# EAGLE design lamloei_breadout_a15001 (EAGLE 7.7.0)
CNAME: LamLoei breadout A15001; CREVISION: R1; DESIGNER: lamloei co.,ltd.
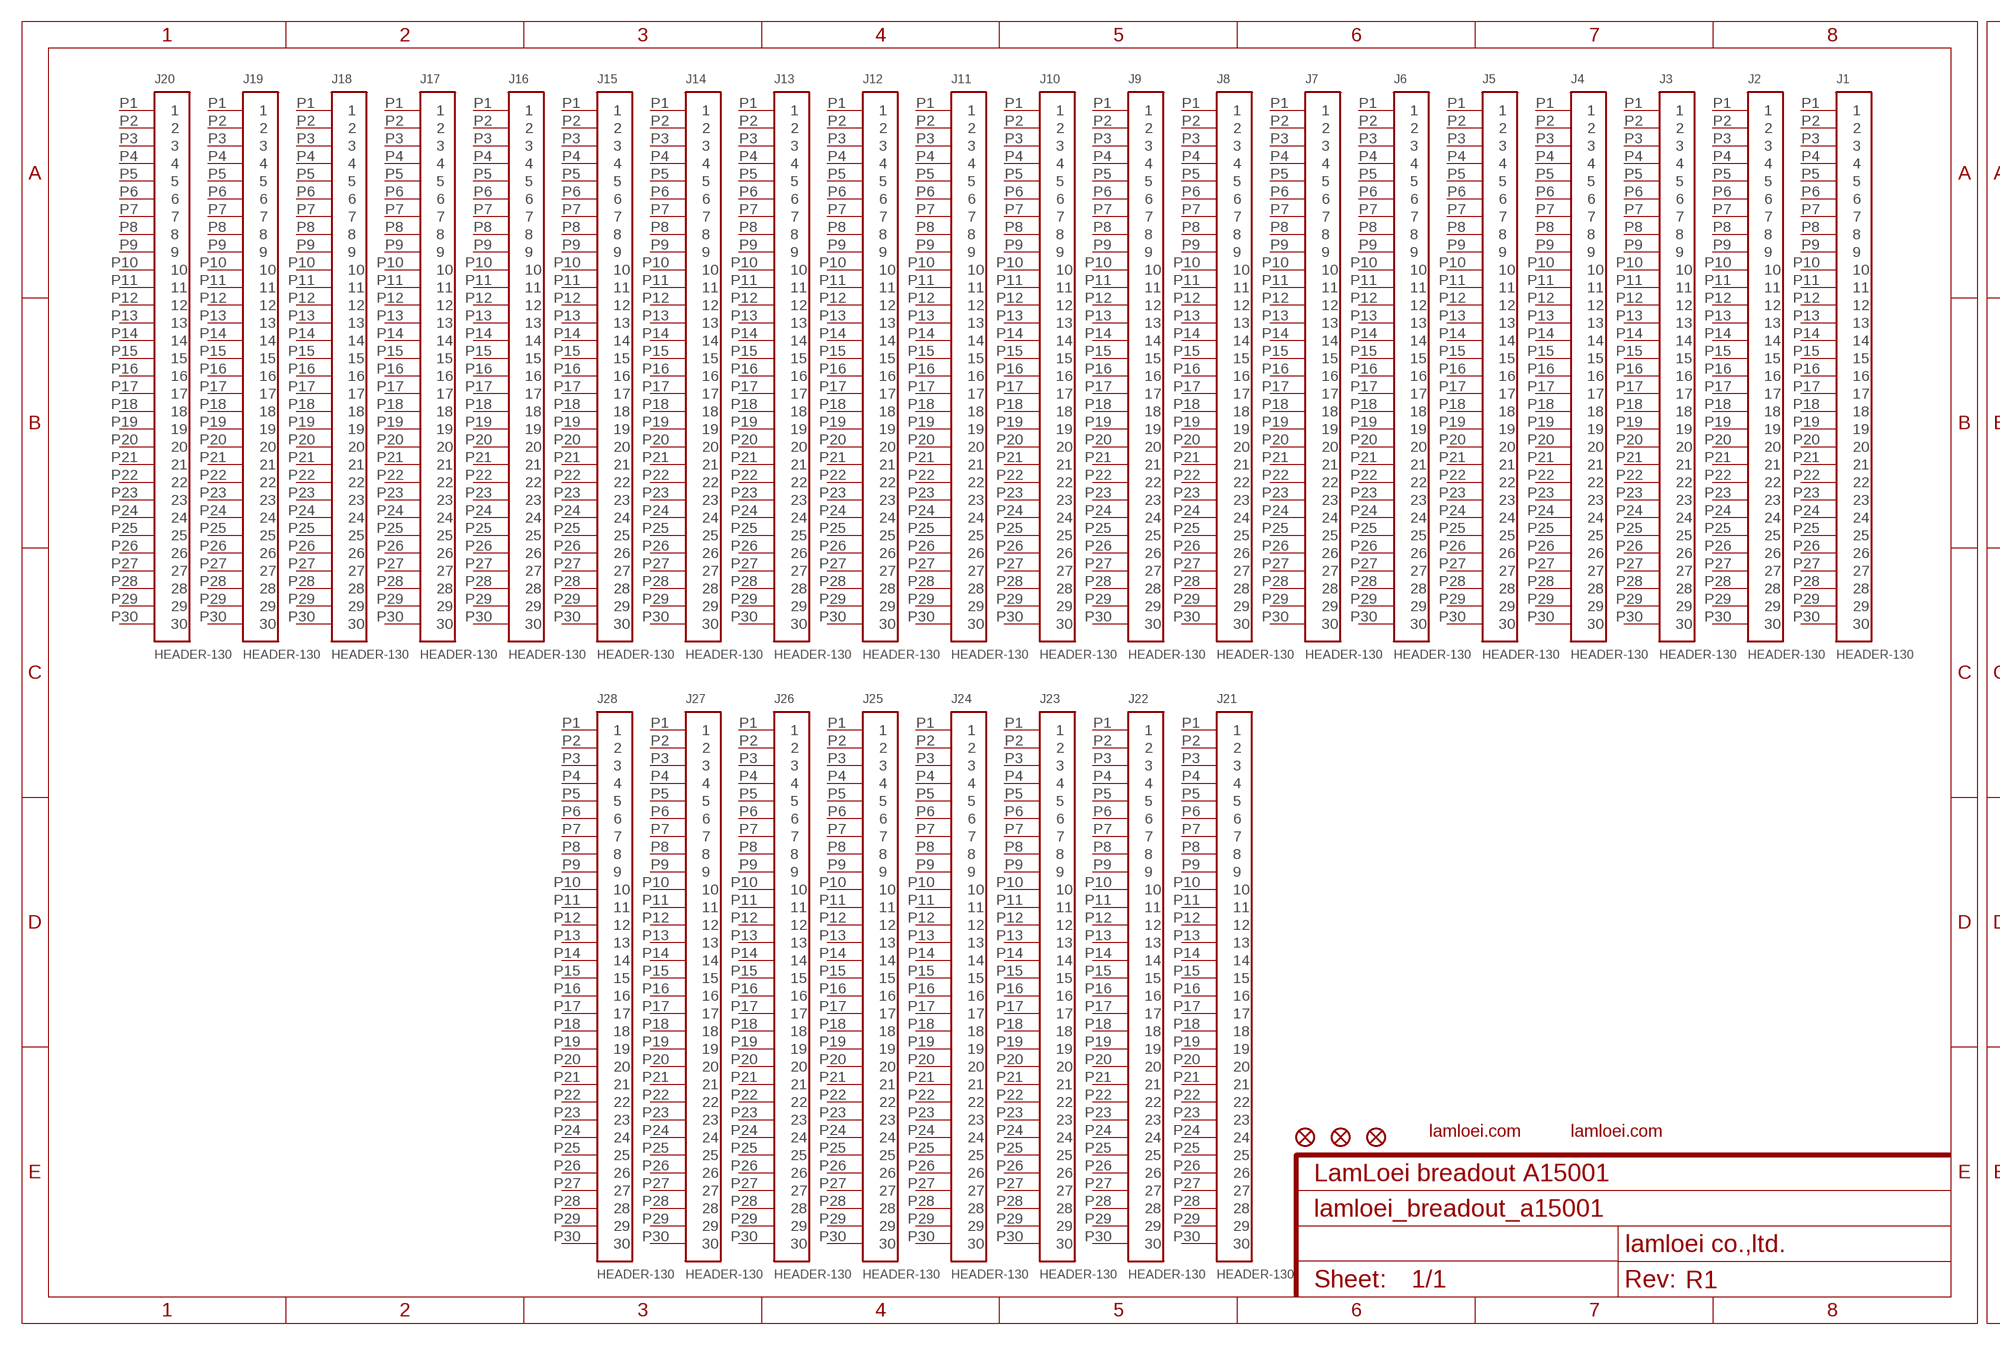
[diagram p0: schematic, sheet 1, part 1 of 2]
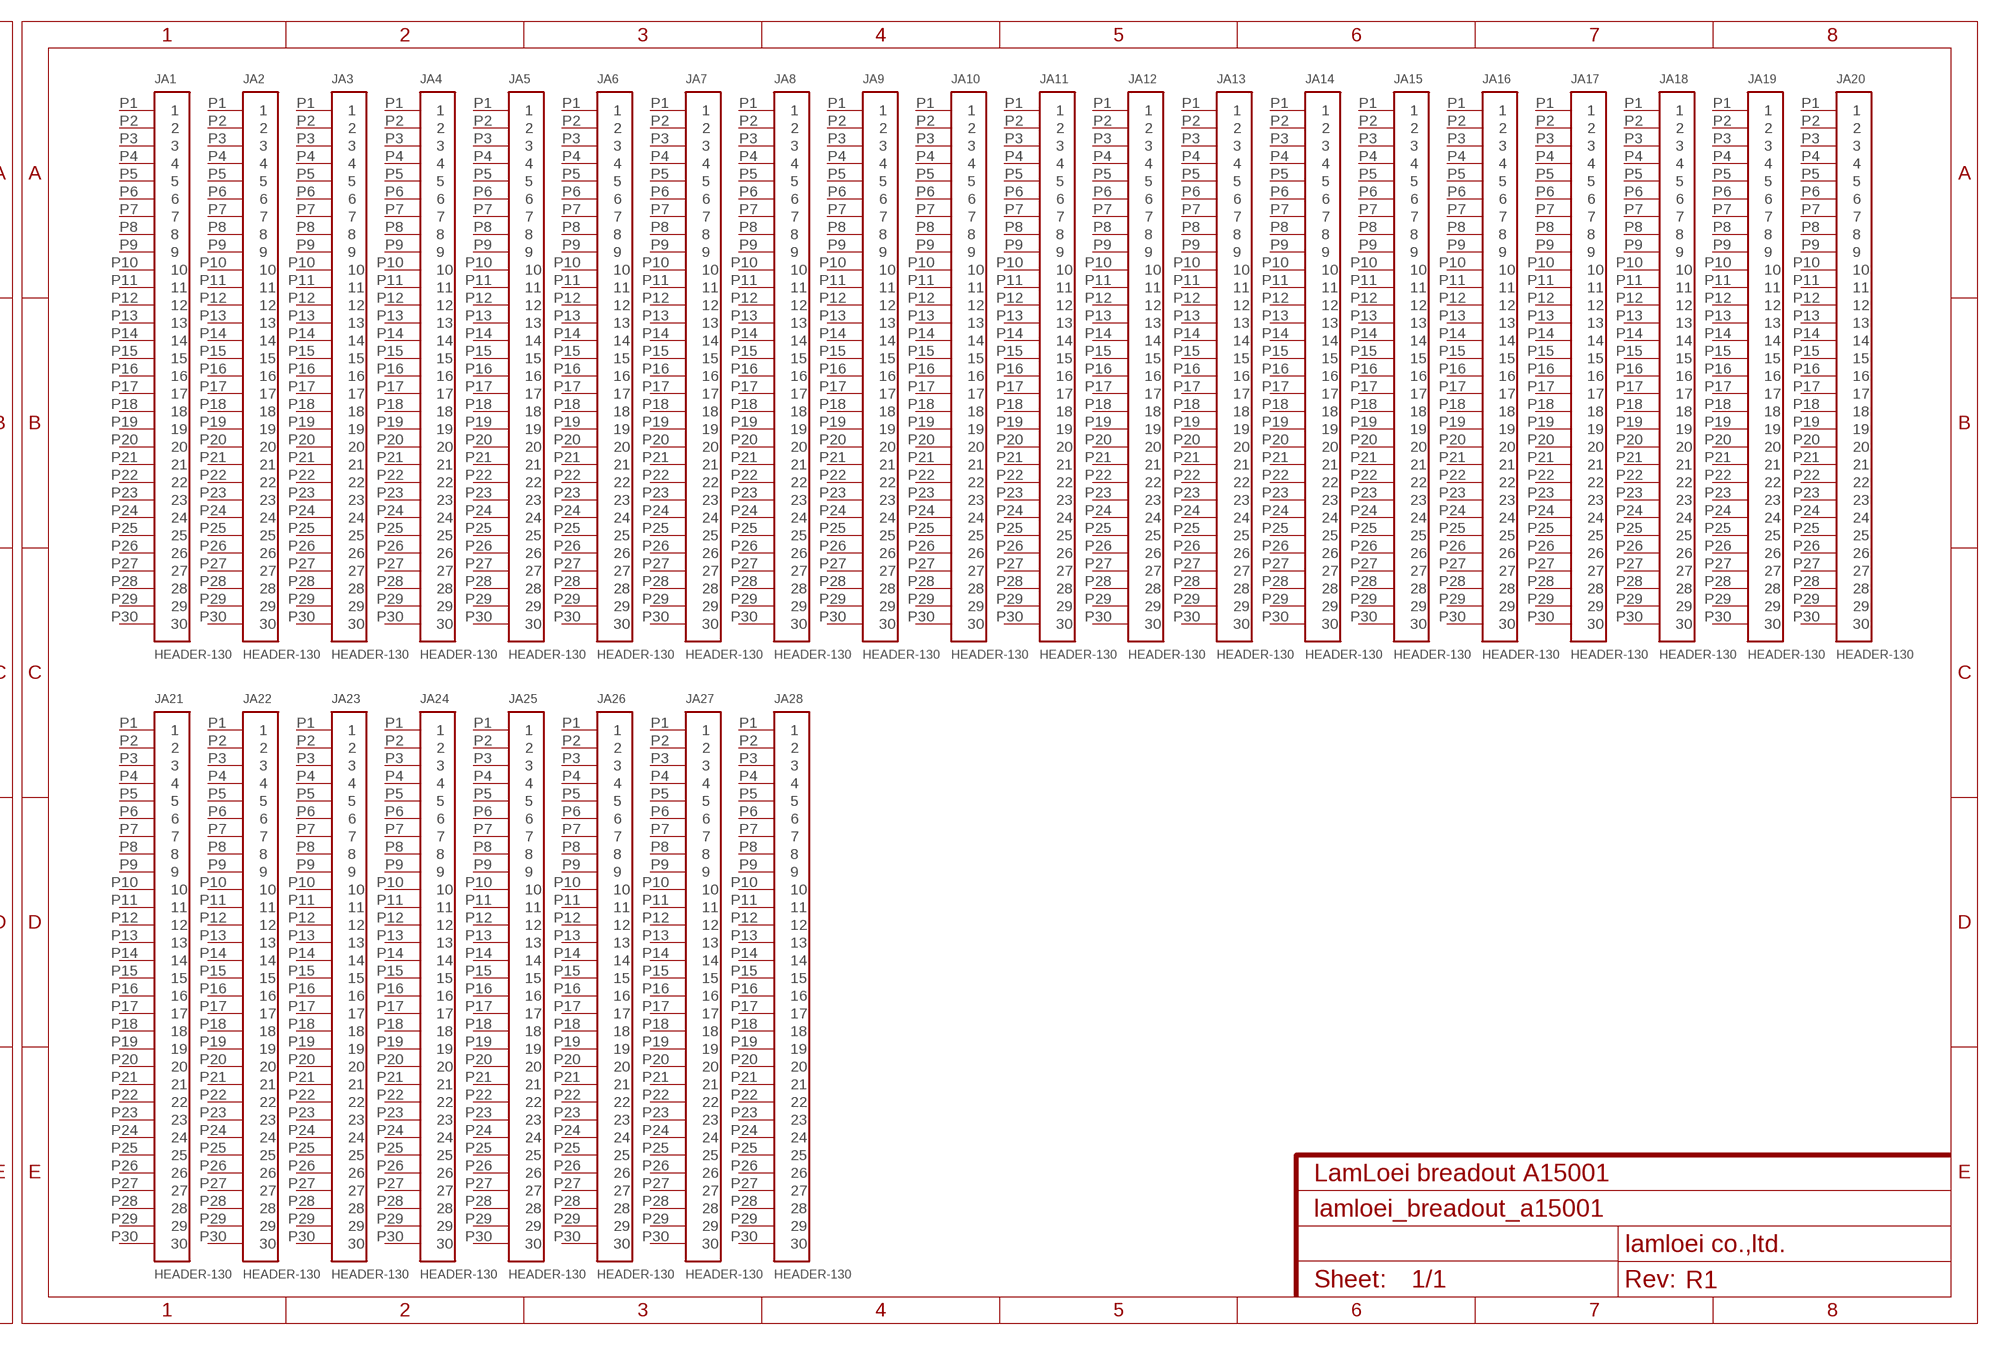
[diagram p1: schematic, sheet 1, part 2 of 2]

## Parts
J1  HEADER-130  [HEADER-130]
J2  HEADER-130  [HEADER-130]
J3  HEADER-130  [HEADER-130]
J4  HEADER-130  [HEADER-130]
J5  HEADER-130  [HEADER-130]
J6  HEADER-130  [HEADER-130]
J7  HEADER-130  [HEADER-130]
J8  HEADER-130  [HEADER-130]
J9  HEADER-130  [HEADER-130]
J10  HEADER-130  [HEADER-130]
J11  HEADER-130  [HEADER-130]
J12  HEADER-130  [HEADER-130]
J13  HEADER-130  [HEADER-130]
J14  HEADER-130  [HEADER-130]
J15  HEADER-130  [HEADER-130]
J16  HEADER-130  [HEADER-130]
J17  HEADER-130  [HEADER-130]
J18  HEADER-130  [HEADER-130]
J19  HEADER-130  [HEADER-130]
J20  HEADER-130  [HEADER-130]
J21  HEADER-130  [HEADER-130]
J22  HEADER-130  [HEADER-130]
J23  HEADER-130  [HEADER-130]
J24  HEADER-130  [HEADER-130]
J25  HEADER-130  [HEADER-130]
J26  HEADER-130  [HEADER-130]
J27  HEADER-130  [HEADER-130]
J28  HEADER-130  [HEADER-130]
JA1  HEADER-130  [HEADER-130]
JA2  HEADER-130  [HEADER-130]
JA3  HEADER-130  [HEADER-130]
JA4  HEADER-130  [HEADER-130]
JA5  HEADER-130  [HEADER-130]
JA6  HEADER-130  [HEADER-130]
JA7  HEADER-130  [HEADER-130]
JA8  HEADER-130  [HEADER-130]
JA9  HEADER-130  [HEADER-130]
JA10  HEADER-130  [HEADER-130]
JA11  HEADER-130  [HEADER-130]
JA12  HEADER-130  [HEADER-130]
JA13  HEADER-130  [HEADER-130]
JA14  HEADER-130  [HEADER-130]
JA15  HEADER-130  [HEADER-130]
JA16  HEADER-130  [HEADER-130]
JA17  HEADER-130  [HEADER-130]
JA18  HEADER-130  [HEADER-130]
JA19  HEADER-130  [HEADER-130]
JA20  HEADER-130  [HEADER-130]
JA21  HEADER-130  [HEADER-130]
JA22  HEADER-130  [HEADER-130]
JA23  HEADER-130  [HEADER-130]
JA24  HEADER-130  [HEADER-130]
JA25  HEADER-130  [HEADER-130]
JA26  HEADER-130  [HEADER-130]
JA27  HEADER-130  [HEADER-130]
JA28  HEADER-130  [HEADER-130]
ZFD1  FIDUCIAL1X2  [FIDUCIAL-1X2]
ZFD2  FIDUCIAL1X2  [FIDUCIAL-1X2]
ZFD3  FIDUCIAL1X2  [FIDUCIAL-1X2]
ZL1  LAMLEOI_LOGO_3  [LAMLEOI_LOGO_3]
ZL2  LAMLEOI_LOGO_3  [LAMLEOI_LOGO_3]
Unconnected: J1.P1 J1.P2 J1.P3 J1.P4 J1.P5 J1.P6 J1.P7 J1.P8 J1.P9 J1.P10 J1.P11 J1.P12 J1.P13 J1.P14 J1.P15 J1.P16 J1.P17 J1.P18 J1.P19 J1.P20 J1.P21 J1.P22 J1.P23 J1.P24 J1.P25 J1.P26 J1.P27 J1.P28 J1.P29 J1.P30 J2.P1 J2.P2 J2.P3 J2.P4 J2.P5 J2.P6 J2.P7 J2.P8 J2.P9 J2.P10 J2.P11 J2.P12 J2.P13 J2.P14 J2.P15 J2.P16 J2.P17 J2.P18 J2.P19 J2.P20 J2.P21 J2.P22 J2.P23 J2.P24 J2.P25 J2.P26 J2.P27 J2.P28 J2.P29 J2.P30 J3.P1 J3.P2 J3.P3 J3.P4 J3.P5 J3.P6 J3.P7 J3.P8 J3.P9 J3.P10 J3.P11 J3.P12 J3.P13 J3.P14 J3.P15 J3.P16 J3.P17 J3.P18 J3.P19 J3.P20 J3.P21 J3.P22 J3.P23 J3.P24 J3.P25 J3.P26 J3.P27 J3.P28 J3.P29 J3.P30 J4.P1 J4.P2 J4.P3 J4.P4 J4.P5 J4.P6 J4.P7 J4.P8 J4.P9 J4.P10 J4.P11 J4.P12 J4.P13 J4.P14 J4.P15 J4.P16 J4.P17 J4.P18 J4.P19 J4.P20 J4.P21 J4.P22 J4.P23 J4.P24 J4.P25 J4.P26 J4.P27 J4.P28 J4.P29 J4.P30 J5.P1 J5.P2 J5.P3 J5.P4 J5.P5 J5.P6 J5.P7 J5.P8 J5.P9 J5.P10 J5.P11 J5.P12 J5.P13 J5.P14 J5.P15 J5.P16 J5.P17 J5.P18 J5.P19 J5.P20 J5.P21 J5.P22 J5.P23 J5.P24 J5.P25 J5.P26 J5.P27 J5.P28 J5.P29 J5.P30 J6.P1 J6.P2 J6.P3 J6.P4 J6.P5 J6.P6 J6.P7 J6.P8 J6.P9 J6.P10 J6.P11 J6.P12 J6.P13 J6.P14 J6.P15 J6.P16 J6.P17 J6.P18 J6.P19 J6.P20 J6.P21 J6.P22 J6.P23 J6.P24 J6.P25 J6.P26 J6.P27 J6.P28 J6.P29 J6.P30 J7.P1 J7.P2 J7.P3 J7.P4 J7.P5 J7.P6 J7.P7 J7.P8 J7.P9 J7.P10 J7.P11 J7.P12 J7.P13 J7.P14 J7.P15 J7.P16 J7.P17 J7.P18 J7.P19 J7.P20 J7.P21 J7.P22 J7.P23 J7.P24 J7.P25 J7.P26 J7.P27 J7.P28 J7.P29 J7.P30 J8.P1 J8.P2 J8.P3 J8.P4 J8.P5 J8.P6 J8.P7 J8.P8 J8.P9 J8.P10 J8.P11 J8.P12 J8.P13 J8.P14 J8.P15 J8.P16 J8.P17 J8.P18 J8.P19 J8.P20 J8.P21 J8.P22 J8.P23 J8.P24 J8.P25 J8.P26 J8.P27 J8.P28 J8.P29 J8.P30 J9.P1 J9.P2 J9.P3 J9.P4 J9.P5 J9.P6 J9.P7 J9.P8 J9.P9 J9.P10 J9.P11 J9.P12 J9.P13 J9.P14 J9.P15 J9.P16 J9.P17 J9.P18 J9.P19 J9.P20 J9.P21 J9.P22 J9.P23 J9.P24 J9.P25 J9.P26 J9.P27 J9.P28 J9.P29 J9.P30 J10.P1 J10.P2 J10.P3 J10.P4 J10.P5 J10.P6 J10.P7 J10.P8 J10.P9 J10.P10 J10.P11 J10.P12 J10.P13 J10.P14 J10.P15 J10.P16 J10.P17 J10.P18 J10.P19 J10.P20 J10.P21 J10.P22 J10.P23 J10.P24 J10.P25 J10.P26 J10.P27 J10.P28 J10.P29 J10.P30 J11.P1 J11.P2 J11.P3 J11.P4 J11.P5 J11.P6 J11.P7 J11.P8 J11.P9 J11.P10 J11.P11 J11.P12 J11.P13 J11.P14 J11.P15 J11.P16 J11.P17 J11.P18 J11.P19 J11.P20 J11.P21 J11.P22 J11.P23 J11.P24 J11.P25 J11.P26 J11.P27 J11.P28 J11.P29 J11.P30 J12.P1 J12.P2 J12.P3 J12.P4 J12.P5 J12.P6 J12.P7 J12.P8 J12.P9 J12.P10 J12.P11 J12.P12 J12.P13 J12.P14 J12.P15 J12.P16 J12.P17 J12.P18 J12.P19 J12.P20 J12.P21 J12.P22 J12.P23 J12.P24 J12.P25 J12.P26 J12.P27 J12.P28 J12.P29 J12.P30 J13.P1 J13.P2 J13.P3 J13.P4 J13.P5 J13.P6 J13.P7 J13.P8 J13.P9 J13.P10 J13.P11 J13.P12 J13.P13 J13.P14 J13.P15 J13.P16 J13.P17 J13.P18 J13.P19 J13.P20 J13.P21 J13.P22 J13.P23 J13.P24 J13.P25 J13.P26 J13.P27 J13.P28 J13.P29 J13.P30 J14.P1 J14.P2 J14.P3 J14.P4 J14.P5 J14.P6 J14.P7 J14.P8 J14.P9 J14.P10 J14.P11 J14.P12 J14.P13 J14.P14 J14.P15 J14.P16 J14.P17 J14.P18 J14.P19 J14.P20 J14.P21 J14.P22 J14.P23 J14.P24 J14.P25 J14.P26 J14.P27 J14.P28 J14.P29 J14.P30 J15.P1 J15.P2 J15.P3 J15.P4 J15.P5 J15.P6 J15.P7 J15.P8 J15.P9 J15.P10 J15.P11 J15.P12 J15.P13 J15.P14 J15.P15 J15.P16 J15.P17 J15.P18 J15.P19 J15.P20 J15.P21 J15.P22 J15.P23 J15.P24 J15.P25 J15.P26 J15.P27 J15.P28 J15.P29 J15.P30 J16.P1 J16.P2 J16.P3 J16.P4 J16.P5 J16.P6 J16.P7 J16.P8 J16.P9 J16.P10 J16.P11 J16.P12 J16.P13 J16.P14 J16.P15 J16.P16 J16.P17 J16.P18 J16.P19 J16.P20 J16.P21 J16.P22 J16.P23 J16.P24 J16.P25 J16.P26 J16.P27 J16.P28 J16.P29 J16.P30 J17.P1 J17.P2 J17.P3 J17.P4 J17.P5 J17.P6 J17.P7 J17.P8 J17.P9 J17.P10 J17.P11 J17.P12 J17.P13 J17.P14 J17.P15 J17.P16 J17.P17 J17.P18 J17.P19 J17.P20 J17.P21 J17.P22 J17.P23 J17.P24 J17.P25 J17.P26 J17.P27 J17.P28 J17.P29 J17.P30 J18.P1 J18.P2 J18.P3 J18.P4 J18.P5 J18.P6 J18.P7 J18.P8 J18.P9 J18.P10 J18.P11 J18.P12 J18.P13 J18.P14 J18.P15 J18.P16 J18.P17 J18.P18 J18.P19 J18.P20 J18.P21 J18.P22 J18.P23 J18.P24 J18.P25 J18.P26 J18.P27 J18.P28 J18.P29 J18.P30 J19.P1 J19.P2 J19.P3 J19.P4 J19.P5 J19.P6 J19.P7 J19.P8 J19.P9 J19.P10 J19.P11 J19.P12 J19.P13 J19.P14 J19.P15 J19.P16 J19.P17 J19.P18 J19.P19 J19.P20 J19.P21 J19.P22 J19.P23 J19.P24 J19.P25 J19.P26 J19.P27 J19.P28 J19.P29 J19.P30 J20.P1 J20.P2 J20.P3 J20.P4 J20.P5 J20.P6 J20.P7 J20.P8 J20.P9 J20.P10 J20.P11 J20.P12 J20.P13 J20.P14 J20.P15 J20.P16 J20.P17 J20.P18 J20.P19 J20.P20 J20.P21 J20.P22 J20.P23 J20.P24 J20.P25 J20.P26 J20.P27 J20.P28 J20.P29 J20.P30 J21.P1 J21.P2 J21.P3 J21.P4 J21.P5 J21.P6 J21.P7 J21.P8 J21.P9 J21.P10 J21.P11 J21.P12 J21.P13 J21.P14 J21.P15 J21.P16 J21.P17 J21.P18 J21.P19 J21.P20 J21.P21 J21.P22 J21.P23 J21.P24 J21.P25 J21.P26 J21.P27 J21.P28 J21.P29 J21.P30 J22.P1 J22.P2 J22.P3 J22.P4 J22.P5 J22.P6 J22.P7 J22.P8 J22.P9 J22.P10 J22.P11 J22.P12 J22.P13 J22.P14 J22.P15 J22.P16 J22.P17 J22.P18 J22.P19 J22.P20 J22.P21 J22.P22 J22.P23 J22.P24 J22.P25 J22.P26 J22.P27 J22.P28 J22.P29 J22.P30 J23.P1 J23.P2 J23.P3 J23.P4 J23.P5 J23.P6 J23.P7 J23.P8 J23.P9 J23.P10 J23.P11 J23.P12 J23.P13 J23.P14 J23.P15 J23.P16 J23.P17 J23.P18 J23.P19 J23.P20 J23.P21 J23.P22 J23.P23 J23.P24 J23.P25 J23.P26 J23.P27 J23.P28 J23.P29 J23.P30 J24.P1 J24.P2 J24.P3 J24.P4 J24.P5 J24.P6 J24.P7 J24.P8 J24.P9 J24.P10 J24.P11 J24.P12 J24.P13 J24.P14 J24.P15 J24.P16 J24.P17 J24.P18 J24.P19 J24.P20 J24.P21 J24.P22 J24.P23 J24.P24 J24.P25 J24.P26 J24.P27 J24.P28 J24.P29 J24.P30 J25.P1 J25.P2 J25.P3 J25.P4 J25.P5 J25.P6 J25.P7 J25.P8 J25.P9 J25.P10 J25.P11 J25.P12 J25.P13 J25.P14 J25.P15 J25.P16 J25.P17 J25.P18 J25.P19 J25.P20 J25.P21 J25.P22 J25.P23 J25.P24 J25.P25 J25.P26 J25.P27 J25.P28 J25.P29 J25.P30 J26.P1 J26.P2 J26.P3 J26.P4 J26.P5 J26.P6 J26.P7 J26.P8 J26.P9 J26.P10 J26.P11 J26.P12 J26.P13 J26.P14 J26.P15 J26.P16 J26.P17 J26.P18 J26.P19 J26.P20 J26.P21 J26.P22 J26.P23 J26.P24 J26.P25 J26.P26 J26.P27 J26.P28 J26.P29 J26.P30 J27.P1 J27.P2 J27.P3 J27.P4 J27.P5 J27.P6 J27.P7 J27.P8 J27.P9 J27.P10 J27.P11 J27.P12 J27.P13 J27.P14 J27.P15 J27.P16 J27.P17 J27.P18 J27.P19 J27.P20 J27.P21 J27.P22 J27.P23 J27.P24 J27.P25 J27.P26 J27.P27 J27.P28 J27.P29 J27.P30 J28.P1 J28.P2 J28.P3 J28.P4 J28.P5 J28.P6 J28.P7 J28.P8 J28.P9 J28.P10 J28.P11 J28.P12 J28.P13 J28.P14 J28.P15 J28.P16 J28.P17 J28.P18 J28.P19 J28.P20 J28.P21 J28.P22 J28.P23 J28.P24 J28.P25 J28.P26 J28.P27 J28.P28 J28.P29 J28.P30 JA1.P1 JA1.P2 JA1.P3 JA1.P4 JA1.P5 JA1.P6 JA1.P7 JA1.P8 JA1.P9 JA1.P10 JA1.P11 JA1.P12 JA1.P13 JA1.P14 JA1.P15 JA1.P16 JA1.P17 JA1.P18 JA1.P19 JA1.P20 JA1.P21 JA1.P22 JA1.P23 JA1.P24 JA1.P25 JA1.P26 JA1.P27 JA1.P28 JA1.P29 JA1.P30 JA2.P1 JA2.P2 JA2.P3 JA2.P4 JA2.P5 JA2.P6 JA2.P7 JA2.P8 JA2.P9 JA2.P10 JA2.P11 JA2.P12 JA2.P13 JA2.P14 JA2.P15 JA2.P16 JA2.P17 JA2.P18 JA2.P19 JA2.P20 JA2.P21 JA2.P22 JA2.P23 JA2.P24 JA2.P25 JA2.P26 JA2.P27 JA2.P28 JA2.P29 JA2.P30 JA3.P1 JA3.P2 JA3.P3 JA3.P4 JA3.P5 JA3.P6 JA3.P7 JA3.P8 JA3.P9 JA3.P10 JA3.P11 JA3.P12 JA3.P13 JA3.P14 JA3.P15 JA3.P16 JA3.P17 JA3.P18 JA3.P19 JA3.P20 JA3.P21 JA3.P22 JA3.P23 JA3.P24 JA3.P25 JA3.P26 JA3.P27 JA3.P28 JA3.P29 JA3.P30 JA4.P1 JA4.P2 JA4.P3 JA4.P4 JA4.P5 JA4.P6 JA4.P7 JA4.P8 JA4.P9 JA4.P10 JA4.P11 JA4.P12 JA4.P13 JA4.P14 JA4.P15 JA4.P16 JA4.P17 JA4.P18 JA4.P19 JA4.P20 JA4.P21 JA4.P22 JA4.P23 JA4.P24 JA4.P25 JA4.P26 JA4.P27 JA4.P28 JA4.P29 JA4.P30 JA5.P1 JA5.P2 JA5.P3 JA5.P4 JA5.P5 JA5.P6 JA5.P7 JA5.P8 JA5.P9 JA5.P10 JA5.P11 JA5.P12 JA5.P13 JA5.P14 JA5.P15 JA5.P16 JA5.P17 JA5.P18 JA5.P19 JA5.P20 JA5.P21 JA5.P22 JA5.P23 JA5.P24 JA5.P25 JA5.P26 JA5.P27 JA5.P28 JA5.P29 JA5.P30 JA6.P1 JA6.P2 JA6.P3 JA6.P4 JA6.P5 JA6.P6 JA6.P7 JA6.P8 JA6.P9 JA6.P10 JA6.P11 JA6.P12 JA6.P13 JA6.P14 JA6.P15 JA6.P16 JA6.P17 JA6.P18 JA6.P19 JA6.P20 JA6.P21 JA6.P22 JA6.P23 JA6.P24 JA6.P25 JA6.P26 JA6.P27 JA6.P28 JA6.P29 JA6.P30 JA7.P1 JA7.P2 JA7.P3 JA7.P4 JA7.P5 JA7.P6 JA7.P7 JA7.P8 JA7.P9 JA7.P10 JA7.P11 JA7.P12 JA7.P13 JA7.P14 JA7.P15 JA7.P16 JA7.P17 JA7.P18 JA7.P19 JA7.P20 JA7.P21 JA7.P22 JA7.P23 JA7.P24 JA7.P25 JA7.P26 JA7.P27 JA7.P28 JA7.P29 JA7.P30 JA8.P1 JA8.P2 JA8.P3 JA8.P4 JA8.P5 JA8.P6 JA8.P7 JA8.P8 JA8.P9 JA8.P10 JA8.P11 JA8.P12 JA8.P13 JA8.P14 JA8.P15 JA8.P16 JA8.P17 JA8.P18 JA8.P19 JA8.P20 JA8.P21 JA8.P22 JA8.P23 JA8.P24 JA8.P25 JA8.P26 JA8.P27 JA8.P28 JA8.P29 JA8.P30 JA9.P1 JA9.P2 JA9.P3 JA9.P4 JA9.P5 JA9.P6 JA9.P7 JA9.P8 JA9.P9 JA9.P10 JA9.P11 JA9.P12 JA9.P13 JA9.P14 JA9.P15 JA9.P16 JA9.P17 JA9.P18 JA9.P19 JA9.P20 JA9.P21 JA9.P22 JA9.P23 JA9.P24 JA9.P25 JA9.P26 JA9.P27 JA9.P28 JA9.P29 JA9.P30 JA10.P1 JA10.P2 JA10.P3 JA10.P4 JA10.P5 JA10.P6 JA10.P7 JA10.P8 JA10.P9 JA10.P10 JA10.P11 JA10.P12 JA10.P13 JA10.P14 JA10.P15 JA10.P16 JA10.P17 JA10.P18 JA10.P19 JA10.P20 JA10.P21 JA10.P22 JA10.P23 JA10.P24 JA10.P25 JA10.P26 JA10.P27 JA10.P28 JA10.P29 JA10.P30 JA11.P1 JA11.P2 JA11.P3 JA11.P4 JA11.P5 JA11.P6 JA11.P7 JA11.P8 JA11.P9 JA11.P10 JA11.P11 JA11.P12 JA11.P13 JA11.P14 JA11.P15 JA11.P16 JA11.P17 JA11.P18 JA11.P19 JA11.P20 JA11.P21 JA11.P22 JA11.P23 JA11.P24 JA11.P25 JA11.P26 JA11.P27 JA11.P28 JA11.P29 JA11.P30 JA12.P1 JA12.P2 JA12.P3 JA12.P4 JA12.P5 JA12.P6 JA12.P7 JA12.P8 JA12.P9 JA12.P10 JA12.P11 JA12.P12 JA12.P13 JA12.P14 JA12.P15 JA12.P16 JA12.P17 JA12.P18 JA12.P19 JA12.P20 JA12.P21 JA12.P22 JA12.P23 JA12.P24 JA12.P25 JA12.P26 JA12.P27 JA12.P28 JA12.P29 JA12.P30 JA13.P1 JA13.P2 JA13.P3 JA13.P4 JA13.P5 JA13.P6 JA13.P7 JA13.P8 JA13.P9 JA13.P10 JA13.P11 JA13.P12 JA13.P13 JA13.P14 JA13.P15 JA13.P16 JA13.P17 JA13.P18 JA13.P19 JA13.P20 JA13.P21 JA13.P22 JA13.P23 JA13.P24 JA13.P25 JA13.P26 JA13.P27 JA13.P28 JA13.P29 JA13.P30 JA14.P1 JA14.P2 JA14.P3 JA14.P4 JA14.P5 JA14.P6 JA14.P7 JA14.P8 JA14.P9 JA14.P10 JA14.P11 JA14.P12 JA14.P13 JA14.P14 JA14.P15 JA14.P16 JA14.P17 JA14.P18 JA14.P19 JA14.P20 JA14.P21 JA14.P22 JA14.P23 JA14.P24 JA14.P25 JA14.P26 JA14.P27 JA14.P28 JA14.P29 JA14.P30 JA15.P1 JA15.P2 JA15.P3 JA15.P4 JA15.P5 JA15.P6 JA15.P7 JA15.P8 JA15.P9 JA15.P10 JA15.P11 JA15.P12 JA15.P13 JA15.P14 JA15.P15 JA15.P16 JA15.P17 JA15.P18 JA15.P19 JA15.P20 JA15.P21 JA15.P22 JA15.P23 JA15.P24 JA15.P25 JA15.P26 JA15.P27 JA15.P28 JA15.P29 JA15.P30 JA16.P1 JA16.P2 JA16.P3 JA16.P4 JA16.P5 JA16.P6 JA16.P7 JA16.P8 JA16.P9 JA16.P10 JA16.P11 JA16.P12 JA16.P13 JA16.P14 JA16.P15 JA16.P16 JA16.P17 JA16.P18 JA16.P19 JA16.P20 JA16.P21 JA16.P22 JA16.P23 JA16.P24 JA16.P25 JA16.P26 JA16.P27 JA16.P28 JA16.P29 JA16.P30 JA17.P1 JA17.P2 JA17.P3 JA17.P4 JA17.P5 JA17.P6 JA17.P7 JA17.P8 JA17.P9 JA17.P10 JA17.P11 JA17.P12 JA17.P13 JA17.P14 JA17.P15 JA17.P16 JA17.P17 JA17.P18 JA17.P19 JA17.P20 JA17.P21 JA17.P22 JA17.P23 JA17.P24 JA17.P25 JA17.P26 JA17.P27 JA17.P28 JA17.P29 JA17.P30 JA18.P1 JA18.P2 JA18.P3 JA18.P4 JA18.P5 JA18.P6 JA18.P7 JA18.P8 JA18.P9 JA18.P10 JA18.P11 JA18.P12 JA18.P13 JA18.P14 JA18.P15 JA18.P16 JA18.P17 JA18.P18 JA18.P19 JA18.P20 JA18.P21 JA18.P22 JA18.P23 JA18.P24 JA18.P25 JA18.P26 JA18.P27 JA18.P28 JA18.P29 JA18.P30 JA19.P1 JA19.P2 JA19.P3 JA19.P4 JA19.P5 JA19.P6 JA19.P7 JA19.P8 JA19.P9 JA19.P10 JA19.P11 JA19.P12 JA19.P13 JA19.P14 JA19.P15 JA19.P16 JA19.P17 JA19.P18 JA19.P19 JA19.P20 JA19.P21 JA19.P22 JA19.P23 JA19.P24 JA19.P25 JA19.P26 JA19.P27 JA19.P28 JA19.P29 JA19.P30 JA20.P1 JA20.P2 JA20.P3 JA20.P4 JA20.P5 JA20.P6 JA20.P7 JA20.P8 JA20.P9 JA20.P10 JA20.P11 JA20.P12 JA20.P13 JA20.P14 JA20.P15 JA20.P16 JA20.P17 JA20.P18 JA20.P19 JA20.P20 JA20.P21 JA20.P22 JA20.P23 JA20.P24 JA20.P25 JA20.P26 JA20.P27 JA20.P28 JA20.P29 JA20.P30 JA21.P1 JA21.P2 JA21.P3 JA21.P4 JA21.P5 JA21.P6 JA21.P7 JA21.P8 JA21.P9 JA21.P10 JA21.P11 JA21.P12 JA21.P13 JA21.P14 JA21.P15 JA21.P16 JA21.P17 JA21.P18 JA21.P19 JA21.P20 JA21.P21 JA21.P22 JA21.P23 JA21.P24 JA21.P25 JA21.P26 JA21.P27 JA21.P28 JA21.P29 JA21.P30 JA22.P1 JA22.P2 JA22.P3 JA22.P4 JA22.P5 JA22.P6 JA22.P7 JA22.P8 JA22.P9 JA22.P10 JA22.P11 JA22.P12 JA22.P13 JA22.P14 JA22.P15 JA22.P16 JA22.P17 JA22.P18 JA22.P19 JA22.P20 JA22.P21 JA22.P22 JA22.P23 JA22.P24 JA22.P25 JA22.P26 JA22.P27 JA22.P28 JA22.P29 JA22.P30 JA23.P1 JA23.P2 JA23.P3 JA23.P4 JA23.P5 JA23.P6 JA23.P7 JA23.P8 JA23.P9 JA23.P10 JA23.P11 JA23.P12 JA23.P13 JA23.P14 JA23.P15 JA23.P16 JA23.P17 JA23.P18 JA23.P19 JA23.P20 JA23.P21 JA23.P22 JA23.P23 JA23.P24 JA23.P25 JA23.P26 JA23.P27 JA23.P28 JA23.P29 JA23.P30 JA24.P1 JA24.P2 JA24.P3 JA24.P4 JA24.P5 JA24.P6 JA24.P7 JA24.P8 JA24.P9 JA24.P10 JA24.P11 JA24.P12 JA24.P13 JA24.P14 JA24.P15 JA24.P16 JA24.P17 JA24.P18 JA24.P19 JA24.P20 JA24.P21 JA24.P22 JA24.P23 JA24.P24 JA24.P25 JA24.P26 JA24.P27 JA24.P28 JA24.P29 JA24.P30 JA25.P1 JA25.P2 JA25.P3 JA25.P4 JA25.P5 JA25.P6 JA25.P7 JA25.P8 JA25.P9 JA25.P10 JA25.P11 JA25.P12 JA25.P13 JA25.P14 JA25.P15 JA25.P16 JA25.P17 JA25.P18 JA25.P19 JA25.P20 JA25.P21 JA25.P22 JA25.P23 JA25.P24 JA25.P25 JA25.P26 JA25.P27 JA25.P28 JA25.P29 JA25.P30 JA26.P1 JA26.P2 JA26.P3 JA26.P4 JA26.P5 JA26.P6 JA26.P7 JA26.P8 JA26.P9 JA26.P10 JA26.P11 JA26.P12 JA26.P13 JA26.P14 JA26.P15 JA26.P16 JA26.P17 JA26.P18 JA26.P19 JA26.P20 JA26.P21 JA26.P22 JA26.P23 JA26.P24 JA26.P25 JA26.P26 JA26.P27 JA26.P28 JA26.P29 JA26.P30 JA27.P1 JA27.P2 JA27.P3 JA27.P4 JA27.P5 JA27.P6 JA27.P7 JA27.P8 JA27.P9 JA27.P10 JA27.P11 JA27.P12 JA27.P13 JA27.P14 JA27.P15 JA27.P16 JA27.P17 JA27.P18 JA27.P19 JA27.P20 JA27.P21 JA27.P22 JA27.P23 JA27.P24 JA27.P25 JA27.P26 JA27.P27 JA27.P28 JA27.P29 JA27.P30 JA28.P1 JA28.P2 JA28.P3 JA28.P4 JA28.P5 JA28.P6 JA28.P7 JA28.P8 JA28.P9 JA28.P10 JA28.P11 JA28.P12 JA28.P13 JA28.P14 JA28.P15 JA28.P16 JA28.P17 JA28.P18 JA28.P19 JA28.P20 JA28.P21 JA28.P22 JA28.P23 JA28.P24 JA28.P25 JA28.P26 JA28.P27 JA28.P28 JA28.P29 JA28.P30

## Library data of the parts
J1-J28 JA1-JA28 = lamloei_e77_HEADER-130B:HEADER-130
ZFD1-ZFD3 = SparkFun-Aesthetics:FIDUCIAL: Fiducial Alignment Points Point-of-reference for pick-and-place machines and other optical instruments.
ZL1 ZL2 = lamloei_logo_3:LAMLEOI_LOGO_3: lamloei

## Board
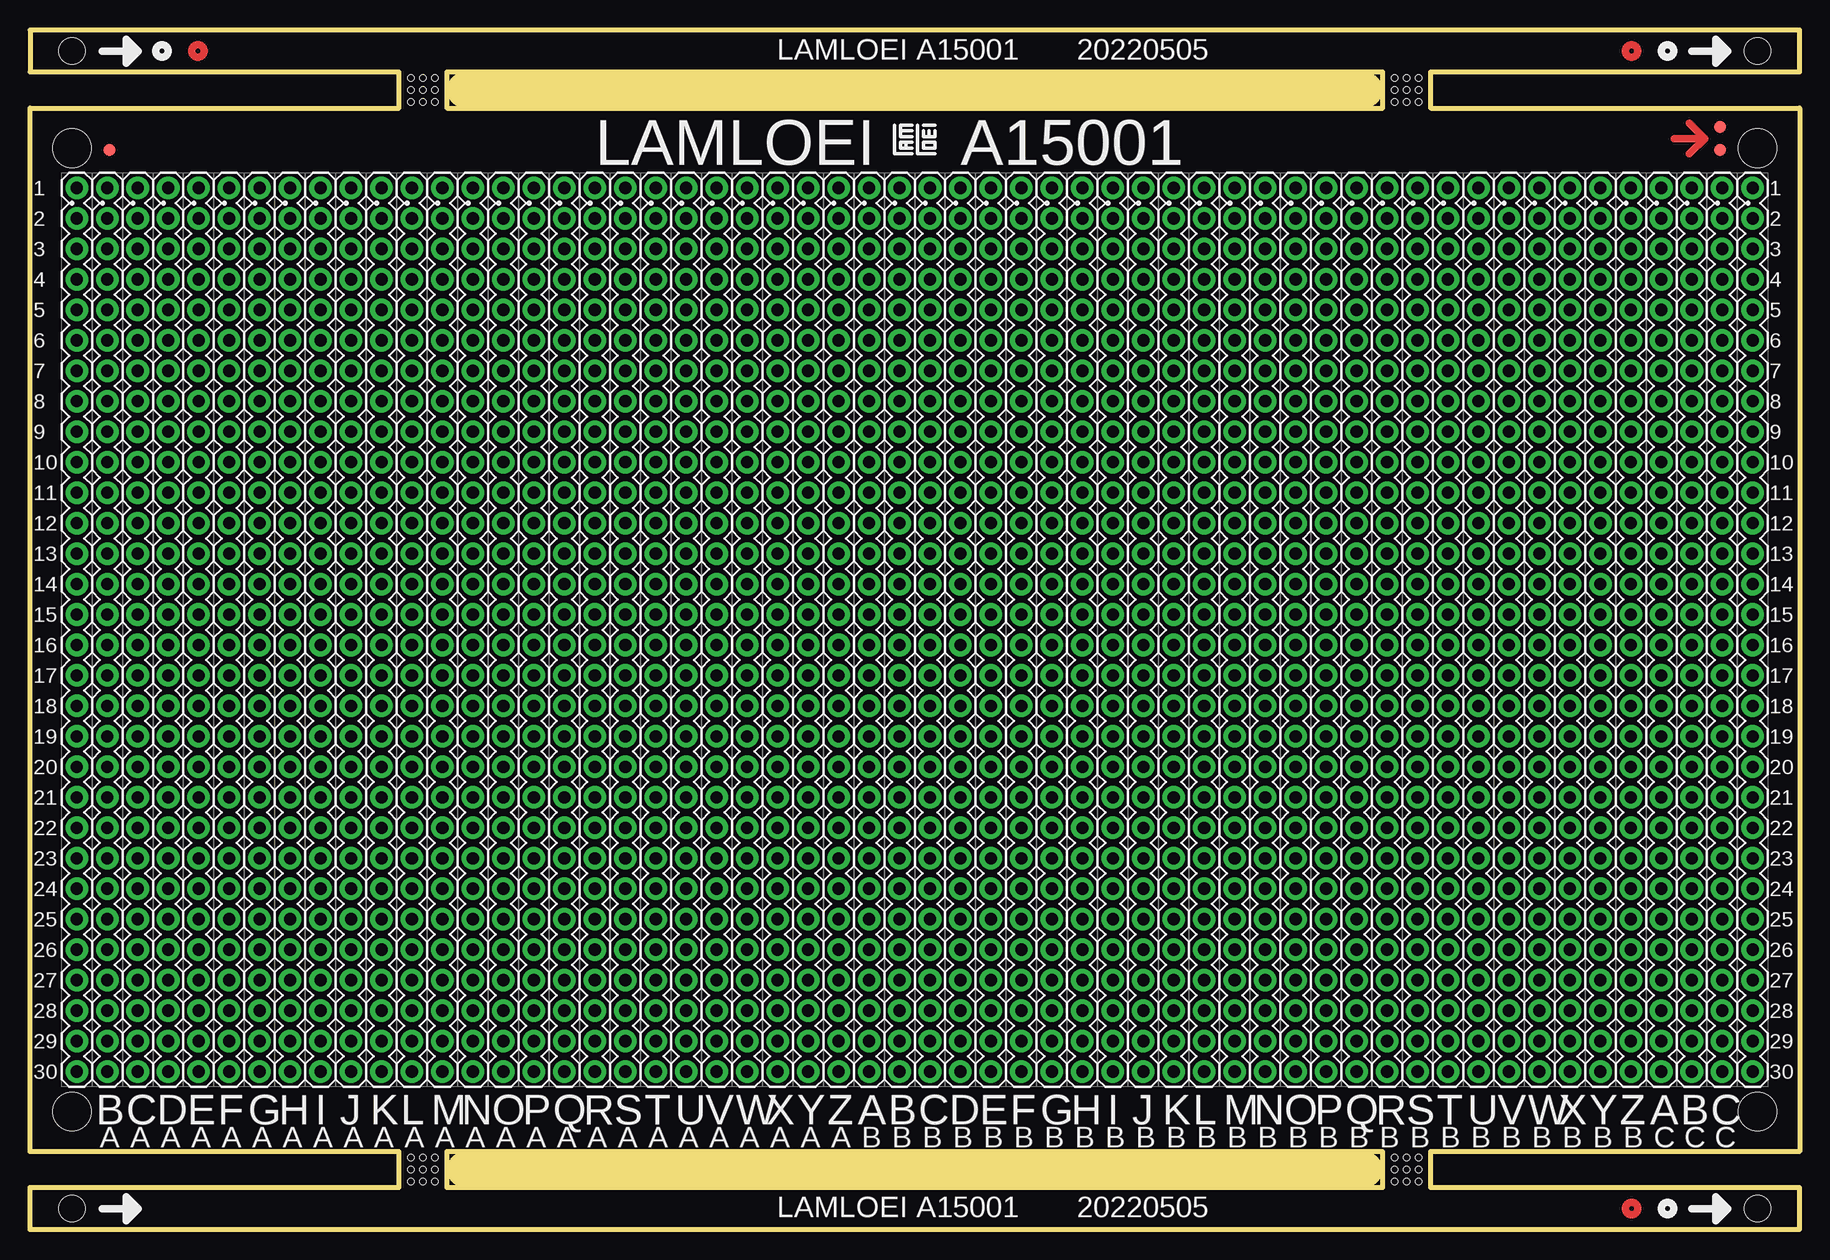
[diagram p2: board, top side]
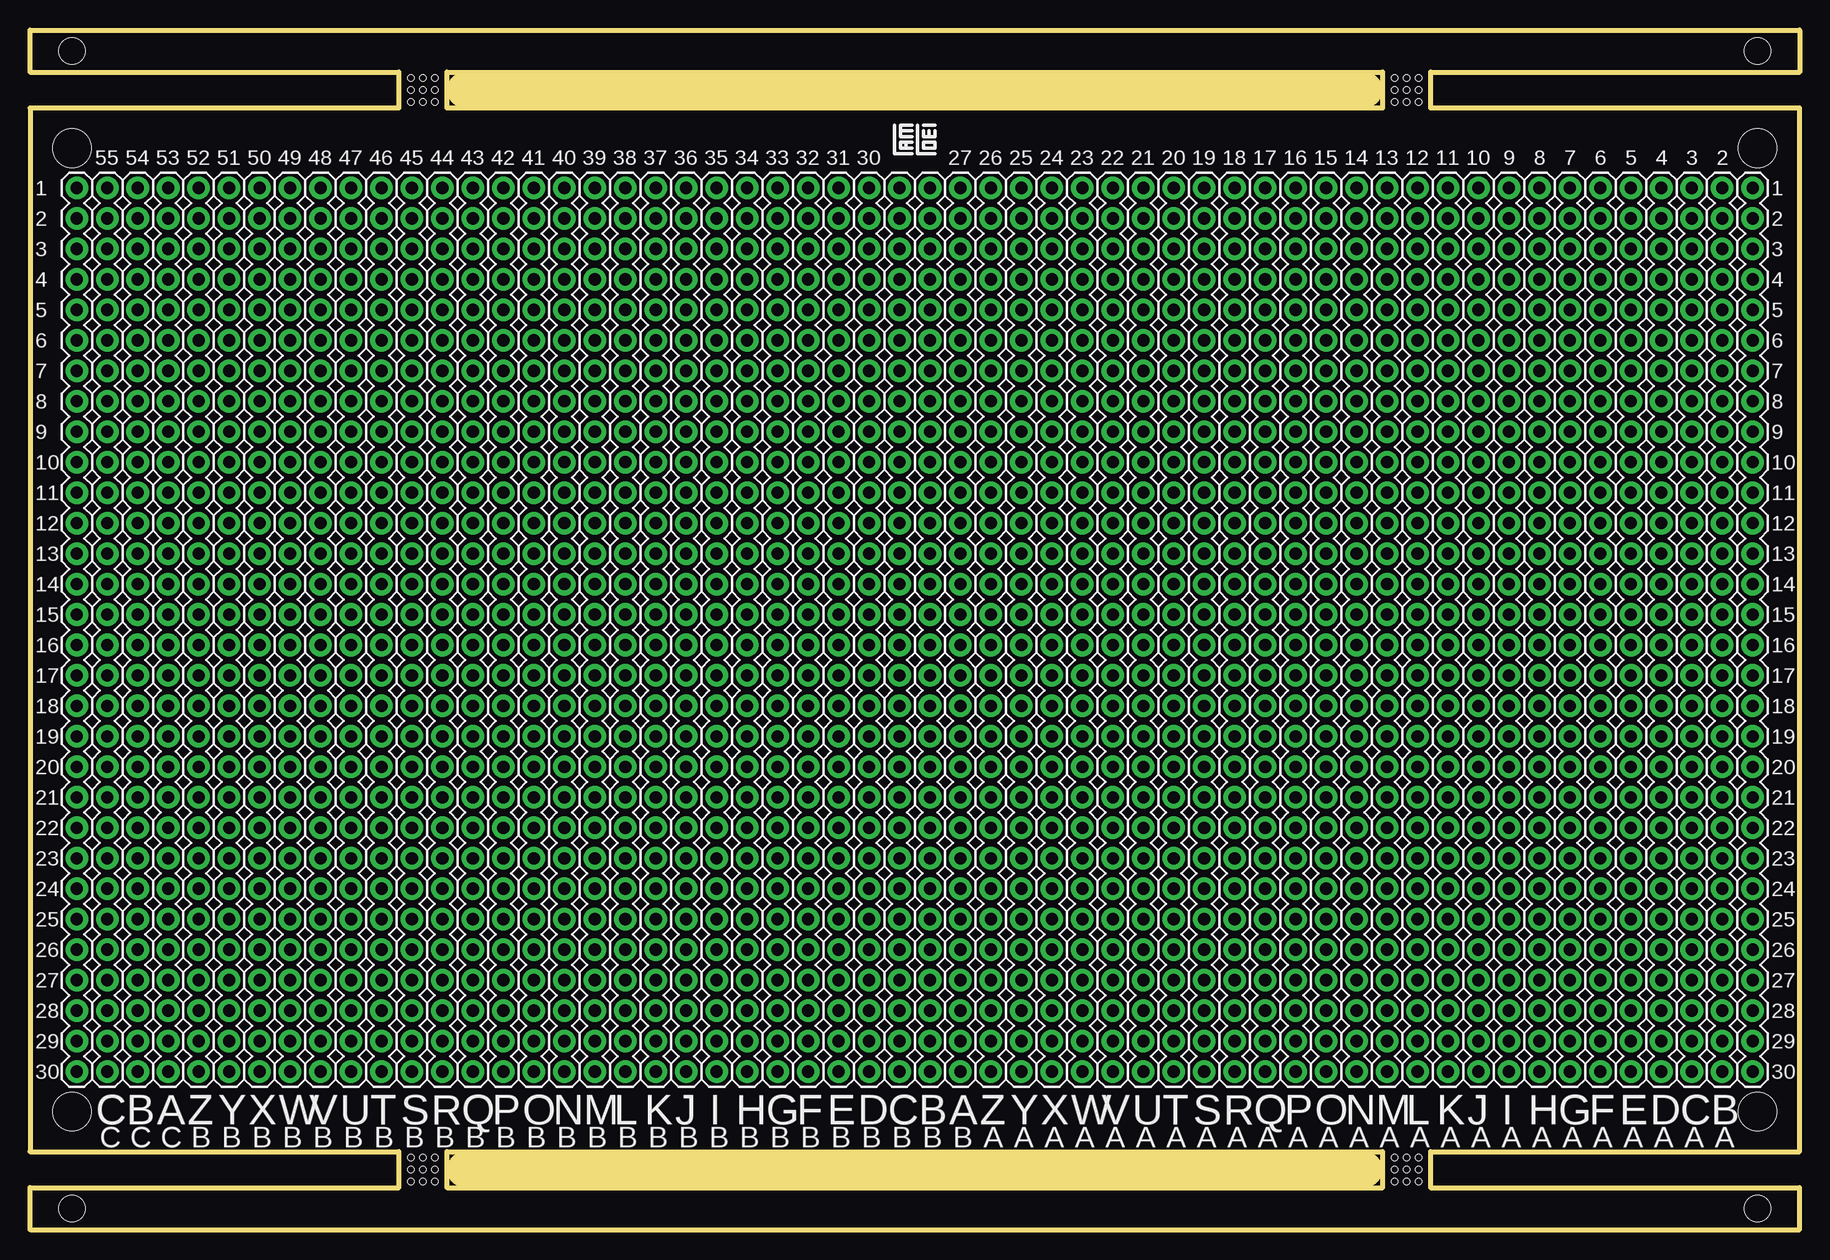
[diagram p3: board, bottom side, seen from below]

Size 147.5 x 100 mm. Coordinates in mm from the lower left corner, seen from the top.
Outline: 0,93.5 30.75,93.5 30.75,96.5 0,96.5 0,100 147.5,100 147.5,96.5 116.75,96.5 116.75,93.5 147.5,93.5 147.5,6.5 116.75,6.5 116.75,3.5 147.5,3.5 147.5,0 0,0 0,3.5 30.75,3.5 30.75,6.5 0,6.5 0,93.5
Outline: 34.75,93.5 112.75,93.5 112.75,96.5 34.75,96.5 34.75,93.5
Outline: 112.75,6.5 34.75,6.5 34.75,3.5 112.75,3.5 112.75,6.5
Copper layers (1*16): Top 0.035mm / dielectric 0.2mm / Bottom 0.035mm
Design rules "jlcpcb-2-layer": minimum track width 3.5mil, minimum drill 0.2mm, track to track 3.5mil, track to pad 5mil, pad to pad 5mil, via to via 5mil, smd to smd 0mil, copper to edge 0.1mm, drill to drill 5mil, minimum pad ring 4mil, minimum via ring 4mil, stop-mask expansion 3mil, vias tented up to drill 100mil, thermal gap 10mil
Holes 3.2 mm at 3.5,9.85 144,9.85 3.5,90.15 144,90.15
Holes 0.5 mm at 32.75,94 33.75,94 31.75,94 31.75,95 31.75,96 32.75,96 32.75,95 33.75,95 33.75,96 114.75,94 113.75,94 113.75,95 113.75,96 114.75,96 114.75,95 115.75,95 115.75,94 115.75,96 32.75,6 31.75,6 31.75,5 31.75,4 32.75,4 32.75,5 33.75,6 33.75,5 33.75,4 114.75,6 113.75,6 113.75,5 113.75,4 114.75,5 114.75,4 115.75,4 115.75,5 115.75,6
Holes 2.2 mm at 3.5,1.75 144,1.75 3.5,98.25 144,98.25
Milling: 2 lines

### Footprints (pad centres in the part's own frame; a part is rotated, then mirrored left to right if it is on the bottom)
HEADER-130 = drill 1.016 pad 1.88: P1 36.83,0; P2 34.29,0; P3 31.75,0; P4 29.21,0; P5 26.67,0; P6 24.13,0; P7 21.59,0; P8 19.05,0; P9 16.51,0; P10 13.97,0; P11 11.43,0; P12 8.89,0; P13 6.35,0; P14 3.81,0; P15 1.27,0; P16 -1.27,0; P17 -3.81,0; P18 -6.35,0; P19 -8.89,0; P20 -11.43,0; P21 -13.97,0; P22 -16.51,0; P23 -19.05,0; P24 -21.59,0; P25 -24.13,0; P26 -26.67,0; P27 -29.21,0; P28 -31.75,0; P29 -34.29,0; P30 -36.83,0
FIDUCIAL-1X2 = smd 1 x 1: 1 0,0

### Placement (x,y rotation side)
J1  72.48,50 90 top
J2  69.94,50 90 top
J3  67.4,50 90 top
J4  64.86,50 90 top
J5  62.32,50 90 top
J6  59.78,50 90 top
J7  57.24,50 90 top
J8  54.7,50 90 top
J9  52.16,50 90 top
J10  49.62,50 90 top
J11  47.08,50 90 top
J12  44.54,50 90 top
J13  42,50 90 top
J14  39.46,50 90 top
J15  36.92,50 90 top
J16  34.38,50 90 top
J17  31.84,50 90 top
J18  29.3,50 90 top
J19  26.76,50 90 top
J20  24.22,50 90 top
J21  21.68,50 90 top
J22  19.14,50 90 top
J23  16.6,50 90 top
J24  14.06,50 90 top
J25  11.52,50 90 top
J26  8.98,50 90 top
J27  6.44,50 90 top
J28  3.9,50 90 top
JA1  75.02,50 90 top
JA2  77.56,50 90 top
JA3  80.1,50 90 top
JA4  82.64,50 90 top
JA5  85.18,50 90 top
JA6  87.72,50 90 top
JA7  90.26,50 90 top
JA8  92.8,50 90 top
JA9  95.34,50 90 top
JA10  97.88,50 90 top
JA11  100.42,50 90 top
JA12  102.96,50 90 top
JA13  105.5,50 90 top
JA14  108.04,50 90 top
JA15  110.58,50 90 top
JA16  113.12,50 90 top
JA17  115.66,50 90 top
JA18  118.2,50 90 top
JA19  120.74,50 90 top
JA20  123.28,50 90 top
JA21  125.82,50 90 top
JA22  128.36,50 90 top
JA23  130.9,50 90 top
JA24  133.44,50 90 top
JA25  135.98,50 90 top
JA26  138.52,50 90 top
JA27  141.06,50 90 top
JA28  143.6,50 90 top
ZFD1  6.63,90 0 top
ZFD2  140.87,91.91 0 top
ZFD3  140.87,90 0 top
ZL1  71.77,89.37 0 top
ZL2  75.73,89.37 0 bottom

### Tracks (layer width: path | path; a pad name or v marks a point on that pad's centre or on a via)
N$1
  Top 0.61: 137.06,90.96 139.6,90.96 | 139.6,90.96 138.33,92.23 | 138.33,89.69 139.6,90.96
(copper drawn outside any net)
  shapes: Top circle x3

### Text on the board
tNames: LAMLOEI A15001 | 20220505 | LAMLOEI | A15001 | 1 | 1 | 2 | 2 | 3 | 3 | 4 | 4 | 5 | 5 | 6 | 6 | 7 | 7 | 8 | 8 | 9 | 9 | 10 | 10 | 11 | 11 | 12 | 12 | 13 | 13 | 14 | 14 | 15 | 15 | 16 | 16 | 17 | 17 | 18 | 18 | 19 | 19 | 20 | 20 | 21 | 21 | 22 | 22 | 23 | 23 | 24 | 24 | 25 | 25 | 26 | 26 | 27 | 27 | 28 | 28 | 29 | 29 | 30 | 30 | B | C | D | E | F | G | H | I | J | K | L | M | N | O | P | Q | R | S | T | U | V | W | X | Y | Z | A | B | C | D | E | F | G | H | I | J | K | L | M | N | O | P | Q | R | S | T | U | V | W | X | Y | Z | A | B | C | A | A | A | A | A | A | A | A | A | A | A | A | A | A | A | A | A | A | A | A | A | A | A | A | A | B | B | B | B | B | B | B | B | B | B | B | B | B | B | B | B | B | B | B | B | B | B | B | B | B | B | C | C | C | LAMLOEI A15001 | 20220505
bNames: 2 | 3 | 4 | 5 | 6 | 7 | 8 | 9 | 10 | 11 | 12 | 13 | 14 | 15 | 16 | 17 | 18 | 19 | 20 | 21 | 22 | 23 | 24 | 25 | 26 | 27 | 30 | 31 | 32 | 33 | 34 | 35 | 36 | 37 | 38 | 39 | 40 | 41 | 42 | 43 | 44 | 45 | 46 | 47 | 48 | 49 | 50 | 51 | 52 | 53 | 54 | 55 | 1 | 1 | 2 | 2 | 3 | 3 | 4 | 4 | 5 | 5 | 6 | 6 | 7 | 7 | 8 | 8 | 9 | 9 | 10 | 10 | 11 | 11 | 12 | 12 | 13 | 13 | 14 | 14 | 15 | 15 | 16 | 16 | 17 | 17 | 18 | 18 | 19 | 19 | 20 | 20 | 21 | 21 | 22 | 22 | 23 | 23 | 24 | 24 | 25 | 25 | 26 | 26 | 27 | 27 | 28 | 28 | 29 | 29 | 30 | 30 | B | C | D | E | F | G | H | I | J | K | L | M | N | O | P | Q | R | S | T | U | V | W | X | Y | Z | A | B | C | D | E | F | G | H | I | J | K | L | M | N | O | P | Q | R | S | T | U | V | W | X | Y | Z | A | B | C | A | A | A | A | A | A | A | A | A | A | A | A | A | A | A | A | A | A | A | A | A | A | A | A | A | B | B | B | B | B | B | B | B | B | B | B | B | B | B | B | B | B | B | B | B | B | B | B | B | B | B | C | C | C